# Altium project VCO.PrjPCB
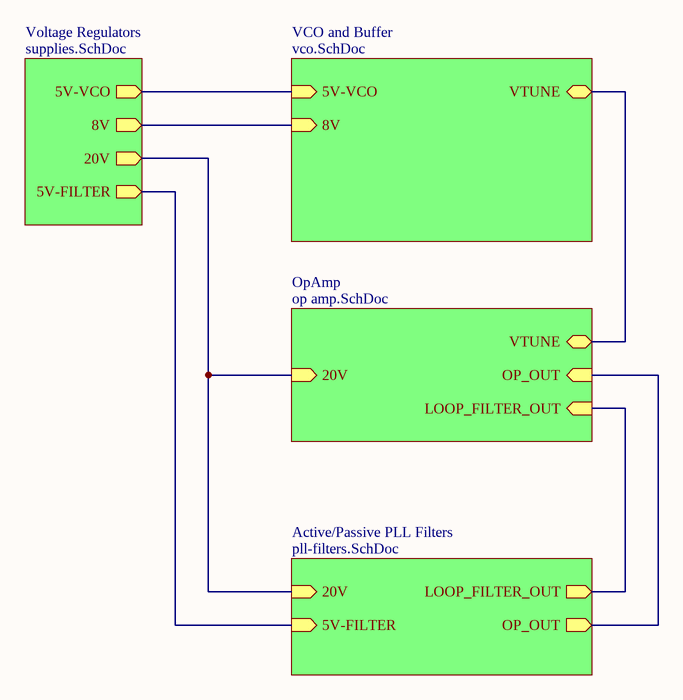
[diagram p0: vco-brd.SchDoc]
5 sheets, 241 parts. Net scope: hierarchical (ports join the sheet entries above them; power ports are global).
Board file: VCO.PcbDoc
Sheets:
  vco-brd.SchDoc
    Voltage Regulators = supplies.SchDoc
    VCO and Buffer = vco.SchDoc
    OpAmp = op amp.SchDoc
    Active/Passive PLL Filters = pll-filters.SchDoc

## Sheet vco-brd.SchDoc
size A

### Sub-sheets
Active/Passive PLL Filters = pll-filters.SchDoc: 5V-FILTER (in), 20V (in), LOOP_FILTER_OUT (out), OP_OUT (out)
OpAmp = op amp.SchDoc: 20V (in), VTUNE (bidir), LOOP_FILTER_OUT (in), OP_OUT (in)
VCO and Buffer = vco.SchDoc: 5V-VCO (in), 8V (in), VTUNE (bidir)
Voltage Regulators = supplies.SchDoc: 5V-VCO (out), 8V (out), 20V (out), 5V-FILTER (out)

### Nets
5V-FILTER: sheet Voltage Regulators/5V-FILTER, sheet Active/Passive PLL Filters/5V-FILTER
5V-VCO: sheet Voltage Regulators/5V-VCO, sheet VCO and Buffer/5V-VCO
8V: sheet Voltage Regulators/8V, sheet VCO and Buffer/8V
20V: sheet Voltage Regulators/20V, sheet OpAmp/20V, sheet Active/Passive PLL Filters/20V
LOOP_FILTER_OUT: sheet OpAmp/LOOP_FILTER_OUT, sheet Active/Passive PLL Filters/LOOP_FILTER_OUT
OP_OUT: sheet OpAmp/OP_OUT, sheet Active/Passive PLL Filters/OP_OUT
VTUNE: sheet VCO and Buffer/VTUNE, sheet OpAmp/VTUNE

## Sheet supplies.SchDoc
size A
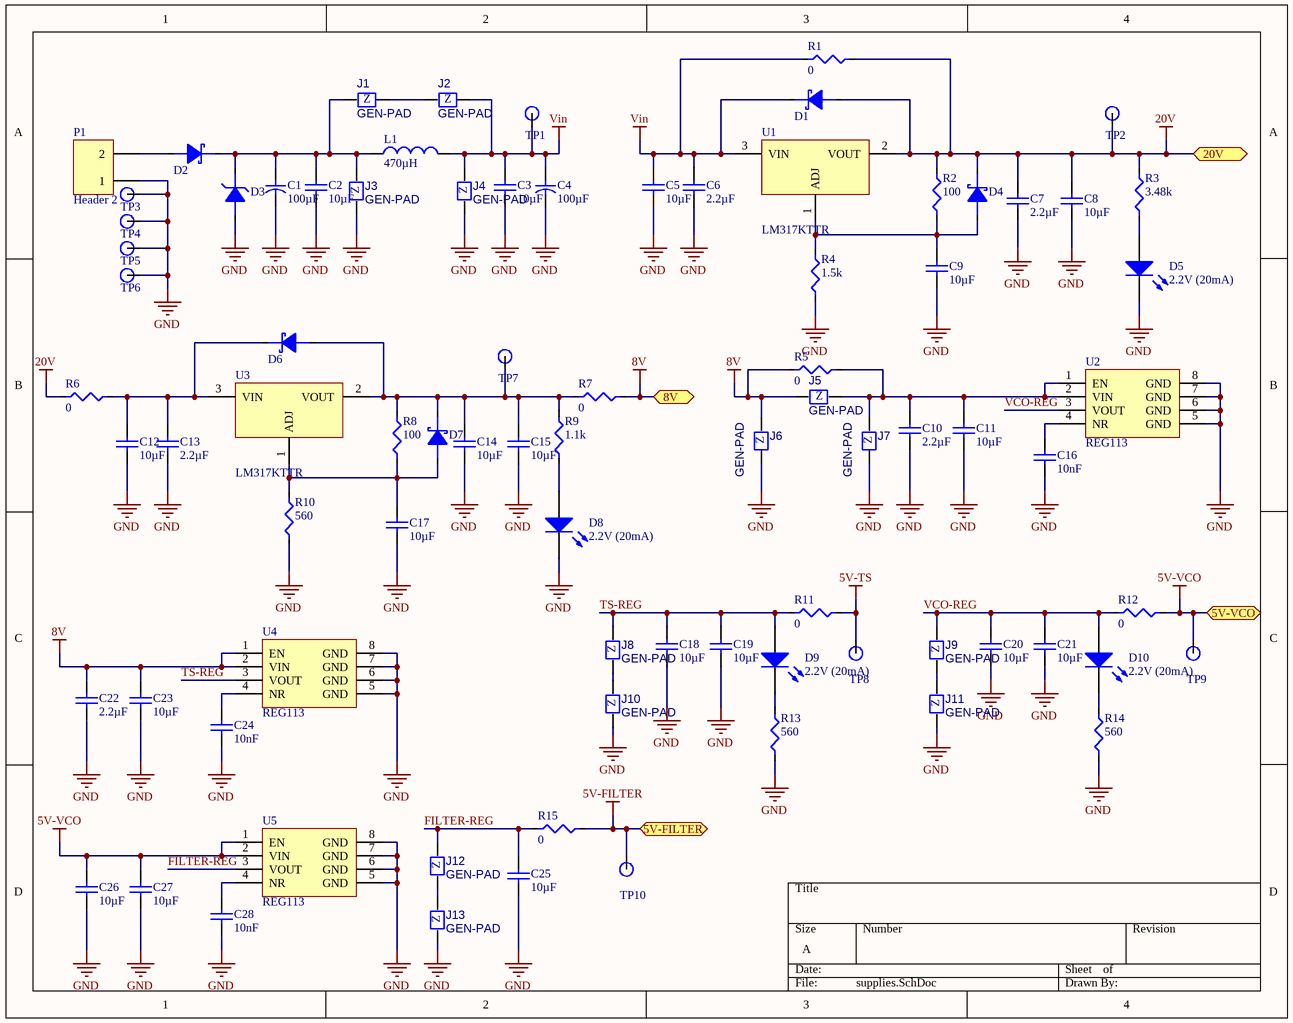
[diagram p1: supplies.SchDoc]

### Parts
C1  100µF  [Radial-SMD-8x10mm]
C2  10µF  [C0805-1.25MM]
C3  10µF  [C0805-1.25MM]
C4  100µF  [Radial-SMD-8x10mm]
C5  10µF  [C0805-1.25MM]
C6  2.2µF  [0402-0.55mm]
C7  2.2µF  [0402-0.55mm]
C8  10µF  [C0805-1.25MM]
C9  10µF  [C0805-1.25MM]
C10  2.2µF  [0402-0.55mm]
C11  10µF  [C0805-1.25MM]
C12  10µF  [C0805-1.25MM]
C13  2.2µF  [0402-0.55mm]
C14  10µF  [0402-0.55mm]
C15  10µF  [0402-0.55mm]
C16  10nF  [C0805-1.25MM]
C17  10µF  [C0805-1.25MM]
C18  10µF  [0402-0.55mm]
C19  10µF  [0402-0.55mm]
C20  10µF  [0402-0.55mm]
C21  10µF  [0402-0.55mm]
C22  2.2µF  [0402-0.55mm]
C23  10µF  [C0805-1.25MM]
C24  10nF  [C0805-1.25MM]
C25  10µF  [0402-0.55mm]
C26  10µF  [0402-0.55mm]
C27  10µF  [0402-0.55mm]
C28  10nF  [C0805-1.25MM]
D1  SCHOTTKY  [SOD-123f]  (value not drawn)
D2  SCHOTTKY  [SOD-123f]  (value not drawn)
D3  ZENER  [DO-214AA]  (value not drawn)
D4  SCHOTTKY  [SOD-123f]  (value not drawn)
D5  2.2V (20mA)  [0805-LED]
D6  SCHOTTKY  [SOD-123f]  (value not drawn)
D7  SCHOTTKY  [SOD-123f]  (value not drawn)
D8  2.2V (20mA)  [0805-LED]
D9  2.2V (20mA)  [0805-LED]
D10  2.2V (20mA)  [0805-LED]
J1  GEN-PAD  [0805-DNP]
J2  GEN-PAD  [0805-DNP]
J3  GEN-PAD  [0805-DNP]
J4  GEN-PAD  [0805-DNP]
J5  GEN-PAD  [0805-DNP]
J6  GEN-PAD  [0805-DNP]
J7  GEN-PAD  [0805-DNP]
J8  GEN-PAD  [0805-DNP]
J9  GEN-PAD  [0805-DNP]
J10  GEN-PAD  [0805-DNP]
J11  GEN-PAD  [0805-DNP]
J12  GEN-PAD  [0805-DNP]
J13  GEN-PAD  [0805-DNP]
L1  value 470µH  [7447709471]  (hidden comment: L)
P1  Header 2  [HDR1X2]
R1  0  [0805-0.45MM]
R2  100  [0805-0.45MM]
R3  3.48k  [0805-0.45MM]
R4  1.5k  [0805-0.45MM]
R5  0  [0805-0.45MM]
R6  0  [0805-0.45MM]
R7  0  [0805-0.45MM]
R8  100  [0805-0.45MM]
R9  1.1k  [0805-0.45MM]
R10  560  [0805-0.45MM]
R11  0  [0805-0.45MM]
R12  0  [0805-0.45MM]
R13  560  [0805-0.45MM]
R14  560  [0805-0.45MM]
R15  0  [0805-0.45MM]
TP1  TP-LOOP  [TP-LOOP]  (value not drawn)
TP2  TP-LOOP  [TP-LOOP]  (value not drawn)
TP3  TP-LOOP  [TP-LOOP]  (value not drawn)
TP4  TP-LOOP  [TP-LOOP]  (value not drawn)
TP5  TP-LOOP  [TP-LOOP]  (value not drawn)
TP6  TP-LOOP  [TP-LOOP]  (value not drawn)
TP7  TP-LOOP  [TP-LOOP]  (value not drawn)
TP8  TP-LOOP  [TP-LOOP]  (value not drawn)
TP9  TP-LOOP  [TP-LOOP]  (value not drawn)
TP10  TP-LOOP  [TP-LOOP]  (value not drawn)
U1  LM317KTTR  [TO-263-4]
U2  REG113  [MSOP8]
U3  LM317KTTR  [TO-263-4]
U4  REG113  [MSOP8]
U5  REG113  [MSOP8]

### Ports
5V-FILTER, 5V-VCO, 8V, 20V

### Nets
5V-FILTER: R15.2 TP10.0 ; port 5V-FILTER
5V-TS: R11.2 TP8.0
5V-VCO: C26.1 C27.1 R12.1 TP9.0 U5.1(EN) U5.2(VIN) ; port 5V-VCO
8V: C22.2 C23.2 J5.2 J6.1 R5.1 R7.2 U4.1(EN) U4.2(VIN) ; port 8V
20V: C7.2 C8.2 D1.A D4.C R1.2 R2.2 R3.2 R6.1 TP2.0 U1.2(VOUT) ; port 20V
GND: C1.1 C2.1 C3.1 C4.1 C5.1 C6.1 C7.1 C8.1 C9.1 C10.1 C11.1 C12.1 C13.1 C14.1 C15.1 C16.1 C17.1 C18.1 C19.1 C20.1 C21.1 C22.1 C23.1 C24.1 C25.2 C26.2 C27.2 C28.1 D3.1(A) D5.C D8.C J3.2 J4.2 J6.2 J7.2 J10.2 J11.2 J13.2 P1.1 R4.1 R10.1 R13.1 R14.1 TP3.0 TP4.0 TP5.0 TP6.0 U2.5(GND) U2.6(GND) U2.7(GND) U2.8(GND) U4.5(GND) U4.6(GND) U4.7(GND) U4.8(GND) U5.5(GND) U5.6(GND) U5.7(GND) U5.8(GND)
Vin: C3.2 C4.2 C5.2 C6.2 D1.C J2.1 J4.1 L1.2 R1.1 TP1.0 U1.3(VIN)
FILTER-REG: C25.1 J12.1 R15.1 U5.3(VOUT)
TS-REG: C18.2 C19.2 D9.A J8.1 R11.1 U4.3(VOUT)
VCO-REG: C20.2 C21.2 D10.A J9.1 R12.2 U2.3(VOUT)
NetC1_2: C1.2 C2.2 D2.C D3.2(C) J1.2 J3.1 L1.1
NetC9_2: C9.2 D4.A R2.1 R4.2 U1.1(ADJ)
NetC10_2: C10.2 C11.2 J5.1 J7.1 R5.2 U2.1(EN) U2.2(VIN)
NetC12_2: C12.2 C13.2 D6.C R6.2 U3.3(VIN)
NetC14_2: C14.2 C15.2 D6.A D7.C R7.1 R8.2 R9.2 TP7.0 U3.2(VOUT)
NetC16_2: C16.2 U2.4(NR)
NetC17_2: C17.2 D7.A R8.1 R10.2 U3.1(ADJ)
NetC24_2: C24.2 U4.4(NR)
NetC28_2: C28.2 U5.4(NR)
NetD2_A: D2.A P1.2
NetD5_A: D5.A R3.1
NetD8_A: D8.A R9.1
NetD9_C: D9.C R13.2
NetD10_C: D10.C R14.2
NetJ1_1: J1.1 J2.2
NetJ8_2: J8.2 J10.1
NetJ9_2: J9.2 J11.1
NetJ12_2: J12.2 J13.1

### Notes on the sheet
- (in symbol EE-GEN-00001) Z

### Library data of the parts
C1 C4 = Radial-SMD-8x10mm: CAP-POL; EE Part Number: EE-CAP-00001; Part Description: CAP ALUM 100UF 50V 20% SMD; Manufacturer: Nichicon; Manufacturer Part Number: UWT1H101MNL1GS; Record Number: 1; Voltage: 50V; Value: 100µF; Datasheet Link: UWT1H101MNL1GS; Supplier 1: DigiKey; Supplier Part Number 1: 493-2226-1-ND; Supplier Link 1: DigiKey; Supplier 2: Mouser; Supplier Part Number 2: 647-UWT1H101MNL1S; Supplier Link 2: Mouser
C2 C3 C5 C8 C9 C12 C17 = C0805-1.25MM: Capacitor; EE Part Number: EE-CAP-00002; Part Description: CAP CER 10UF 35V 10% JB 0805; Manufacturer: TDK; Manufacturer Part Number: C2012JB1V106K085AC; Record Number: 2; Voltage: 35V; PackageDescription: Chip Capacitor; Value: 10µF; Datasheet Link: C2012JB1V106K085AC; Supplier 1: DigiKey; Supplier Part Number 1: 445-11516-1-ND; Supplier Link 1: DigiKey
C6 C7 C13 = 0402-0.55mm: Capacitor; EE Part Number: EE-CAP-00003; Part Description: CAP CER 2.2UF 35V 10% X5R 0402; Manufacturer: TDK; Manufacturer Part Number: C1005X5R1V225K050BC; Record Number: 3; Voltage: 35V; PackageDescription: Chip Capacitor; Value: 2.2µF; Datasheet Link: C1005X5R1V225K050BC; Supplier 1: DigiKey; Supplier Part Number 1: 445-9028-1-ND; Supplier Link 1: DigiKey; Supplier 2: Mouser; Supplier Part Number 2: 810-C1005X5R1V225K; Supplier Link 2: Mouser
C10 C22 = EE-CAP-00003: Capacitor; Part Description: CAP CER 2.2UF 35V 10% X5R 0402; Manufacturer: TDK; Manufacturer Part Number: C1005X5R1V225K050BC; Record Number: 3; Voltage: 35V; PackageDescription: Chip Capacitor; EE Part Number: EE-CAP-00003; Value: 2.2µF; Datasheet Link: C1005X5R1V225K050BC; Supplier 1: DigiKey; Supplier Part Number 1: 445-9028-1-ND; Supplier Link 1: DigiKey; Supplier 2: Mouser; Supplier Part Number 2: 810-C1005X5R1V225K; Supplier Link 2: Mouser
C11 C23 = EE-CAP-00002: Capacitor; Part Description: CAP CER 10UF 35V 10% JB 0805; Manufacturer: TDK; Manufacturer Part Number: C2012JB1V106K085AC; Record Number: 2; Voltage: 35V; PackageDescription: Chip Capacitor; EE Part Number: EE-CAP-00002; Value: 10µF; Datasheet Link: C2012JB1V106K085AC; Supplier 1: DigiKey; Supplier Part Number 1: 445-11516-1-ND; Supplier Link 1: DigiKey
C14 C15 = EE-CAP-00009: Capacitor; Part Description: CAP CER 10UF 10V 20% X5R 0402; Manufacturer: Samsung; Manufacturer Part Number: CL05A106MP5NUNC; Record Number: 9; Voltage: 10V; PackageDescription: Chip Capacitor; EE Part Number: EE-CAP-00009; Value: 10µF; Datasheet Link: CL05A106MP5NUNC; Supplier 1: DigiKey; Supplier Part Number 1: 1276-1450-1-ND; Supplier Link 1: DigiKey
C16 C24 C28 = EE-CAP-00010: Capacitor; Part Description: CAP CER 10000PF 50V 10% X7R 0805; Manufacturer: Murata; Manufacturer Part Number: GRM216R71H103KA01D; Record Number: 10; Voltage: 50V; PackageDescription: Chip Capacitor; EE Part Number: EE-CAP-00010; Value: 10nF; Datasheet Link: GRM216R71H103KA01D; Supplier 1: DigiKey; Supplier Part Number 1: 490-1664-1-ND; Supplier Link 1: DigiKey; Supplier 2: Mouser; Supplier Part Number 2: 81-GRM40X103K50D; Supplier Link 2: Mouser
C18-C21 C25-C27 = EE-CAP-00004: Capacitor; Part Description: CAP CER 10UF 10V 20% X5R 0402; Manufacturer: Samsung; Manufacturer Part Number: CL05A106MP5NUNC; Record Number: 4; Voltage: 10V; PackageDescription: Chip Capacitor; EE Part Number: EE-CAP-00004; Value: 10µF; Datasheet Link: CL05A106MP5NUNC; Supplier 1: DigiKey; Supplier Part Number 1: 1276-1450-1-ND; Supplier Link 1: DigiKey
D1 D2 D4 D6 D7 = 1A: Schottky Diode; EE Part Number: EE-DIODE-00002; Part Description: DIODE SCHOTTKY 30V 1A SFLAT; Manufacturer: Toshiba; Manufacturer Part Number: CRS01(TE85L,Q,M); Record Number: 2; Value: 30V (1A); Voltage: 30V; Current: 1A; Datasheet Link: CRS01(TE85L,Q,M); Supplier 1: DigiKey; Supplier Part Number 1: CRS01QCT-ND; Supplier Link 1: DigiKey; Supplier 2: Mouser; Supplier Part Number 2: 757-CRS01(TE85L,Q,M); Supplier Link 2: Mouser
D3 = EE-DIODE-00004: Part Description: DIODE ZENER 25V 5W DO214AA; Manufacturer: Micro; Manufacturer Part Number: SMBJ5360B-TP; Record Number: 4; Value: 25V (190mA); Voltage: 25V; Current: 190mA; EE Part Number: EE-DIODE-00004; Datasheet Link: SMBJ5360B-TP; Supplier 1: DigiKey; Supplier Part Number 1: SMBJ5360B-TPMSCT-ND; Supplier Link 1: DigiKey
D5 D8-D10 = EE-DIODE-00003: LED; Part Description: LED CHIPLED 570NM GREEN 0805 SMD; Manufacturer: OSRAM; Manufacturer Part Number: LG R971-KN-1; Record Number: 3; Revision: July-2002: Re-released for DXP Platform.; EE Part Number: EE-DIODE-00003; Value: 2.2V (20mA); Voltage: 2.2V; Current: 20mA; Datasheet Link: LG R971-KN-1; Supplier 1: DigiKey; Supplier Part Number 1: 475-1410-1-ND; Supplier Link 1: DigiKey; Supplier 2: Mouser; Supplier Part Number 2: 720-LGR971-KN-1; Supplier Link 2: Mouser
J1-J13 = EE-GEN-00001: Generic Component; Part Description: 0805 Generic Comp; Record Number: 1; EE Part Number: EE-GEN-00001; Value: GEN-0805; Pins: 2; Manufacturer: N/A; Manufacturer Part Number: N/A; Supplier 1: N/A; Supplier Part Number 1: N/A
L1 = 1.4A: Inductor; EE Part Number: EE-L-00002; Part Description: INDUCTOR POWER 470UH 1.4A SMD; Manufacturer: Wurth; Record Number: 2; Current: 1.4A; Tolerance: ±20%; Resistance: 560 mOhm Max; Manufacturer Part Number: 7447709471; Datasheet Link: 7447709471; Supplier 1: DigiKey; Supplier Part Number 1: 732-1699-1-ND; Supplier Link 1: DigiKey; Supplier 2: Mouser; Supplier Part Number 2: 710-7447709471; Supplier Link 2: Mouser
P1 = EM-CON-00012: Part Description: 2-Pin 0.1" Vertical Header; Manufacturer: 3M; Record Number: 12; Value: 961102-6404-AR; EM Part Number: EM-CON-00012; Pins: 2; Manufacturer Part Number: 961102-6404-AR; Supplier 1: Digi-Key; Supplier Part Number 1: 3M9447-ND
R1 R5-R7 R11 R12 R15 = EM-RES-01617: Part Description: RES 0.0 OHM .33W 0805 SMD; Manufacturer: Vishay; Manufacturer Part Number: CRCW08050000Z0EAHP; Record Number: 1617; Power: 0.33W; EM Part Number: EM-RES-01617; Value: 0; Tolerance: N/A; Datasheet Link: http://www.vishay.com/docs/20043/crcwhpe3.pdf; Supplier 1: Digi-Key; Supplier Part Number 1: 541-0.0TBCT-ND; Supplier Link 1: http://www.Digi-Key.com/product-detail/en/CRCW08050000Z0EAHP/541-0.0TBCT-ND/2222831
R2 R8 = EM-RES-01370: Part Description: RES 100 OHM 1/8W 1% 0805 SMD; Manufacturer: Vishay; Manufacturer Part Number: CRCW0805100RFKEA; Record Number: 1370; Tolerance: 1%; Power: 0.125W; EM Part Number: EM-RES-01370; Value: 100; Supplier 1: Digi-Key; Supplier Part Number 1: 541-100CCT-ND
R3 = EM-RES-01196: Part Description: RES 3.48K OHM 1/8W 1% 0805 SMD; Manufacturer: Vishay; Manufacturer Part Number: CRCW08053K48FKEA; Record Number: 1196; Tolerance: 1%; Power: 0.125W; EM Part Number: EM-RES-01196; Value: 3.48k; Supplier 1: Digi-Key; Supplier Part Number 1: 541-3.48KCCT-ND
R4 = EM-RES-01238: Part Description: RES 1.50K OHM 1/8W 1% 0805 SMD; Manufacturer: Vishay; Manufacturer Part Number: CRCW08051K50FKEA; Record Number: 1238; Tolerance: 1%; Power: 0.125W; EM Part Number: EM-RES-01238; Value: 1.5k; Supplier 1: Digi-Key; Supplier Part Number 1: 541-1.50KCCT-ND
R9 = EM-RES-01252: Part Description: RES 1.10K OHM 1/8W 1% 0805 SMD; Manufacturer: Vishay; Manufacturer Part Number: CRCW08051K10FKEA; Record Number: 1252; Tolerance: 1%; Power: 0.125W; EM Part Number: EM-RES-01252; Value: 1.1k; Supplier 1: Digi-Key; Supplier Part Number 1: 541-1.10KCCT-ND
R10 R13 R14 = EM-RES-01285: Part Description: RES 560 OHM 1/8W 1% 0805 SMD; Manufacturer: Vishay; Manufacturer Part Number: CRCW0805560RFKEA; Record Number: 1285; Tolerance: 1%; Power: 0.125W; EM Part Number: EM-RES-01285; Value: 560; Supplier 1: Digi-Key; Supplier Part Number 1: 541-560CCT-ND
TP1-TP10 = EM-TP-00006: Part Description: 0.040" Test Point; Record Number: 6; EM Part Number: EM-TP-00006; Value: TP-LOOP; Pins: 1; Manufacturer: N/A; Manufacturer Part Number: N/A; Supplier 1: N/A; Supplier Part Number 1: N/A
U1 U3 = EE-VREG-00004: Part Description: IC REG LDO ADJ 1.5A DDPAK; Manufacturer: TI; Record Number: 4; Input Voltage: 4.2 V ~ 40 V; Fixed/Adjustable: Positive Adjustable; Output Voltage: 1.25 V ~ 37 V; EE Part Number: EE-VREG-00004; Value: LM317KTTR; Type: Buck; Manufacturer Part Number: LM317KTTR; Datasheet Link: LM317KTTR; Supplier 1: DigiKey; Supplier Part Number 1: 296-21390-1-ND; Supplier Link 1: DigiKey; Supplier 2: Mouser; Supplier Part Number 2: 595-LM317KTTR; Supplier Link 2: Mouser
U2 U4 = EE-VREG-00002: Part Description: IC REG LDO 5V 0.4A 8VSSOP; Manufacturer: TI; Record Number: 2; Value: REG113EA-5/250; Input Voltage: Up to 10V; Fixed/Adjustable: Positive Fixed; Output Voltage: 5V; EE Part Number: EE-VREG-00002; Type: Buck; Manufacturer Part Number: REG113EA-5/250; Datasheet Link: REG113EA-5/250; Supplier 1: DigiKey; Supplier Part Number 1: 296-29170-1-ND; Supplier Link 1: DigiKey; Supplier 2: Mouser; Supplier Part Number 2: 595-REG113EA-5/250; Supplier Link 2: Mouser
U5 = EE-VREG-00003: Part Description: IC REG LDO 2.5V 0.4A 8VSSOP; Manufacturer: TI; Record Number: 3; Value: REG113EA-2.5/2K5; Input Voltage: Up to 10V; Fixed/Adjustable: Positive Fixed; Output Voltage: 2.5V; EE Part Number: EE-VREG-00003; Type: Buck; Manufacturer Part Number: REG113EA-2.5/2K5; Datasheet Link: REG113EA-2.5/2K5; Supplier 1: DigiKey; Supplier Part Number 1: REG113EA2.52K5CT-ND; Supplier Link 1: DigiKey

## Sheet vco.SchDoc
size A
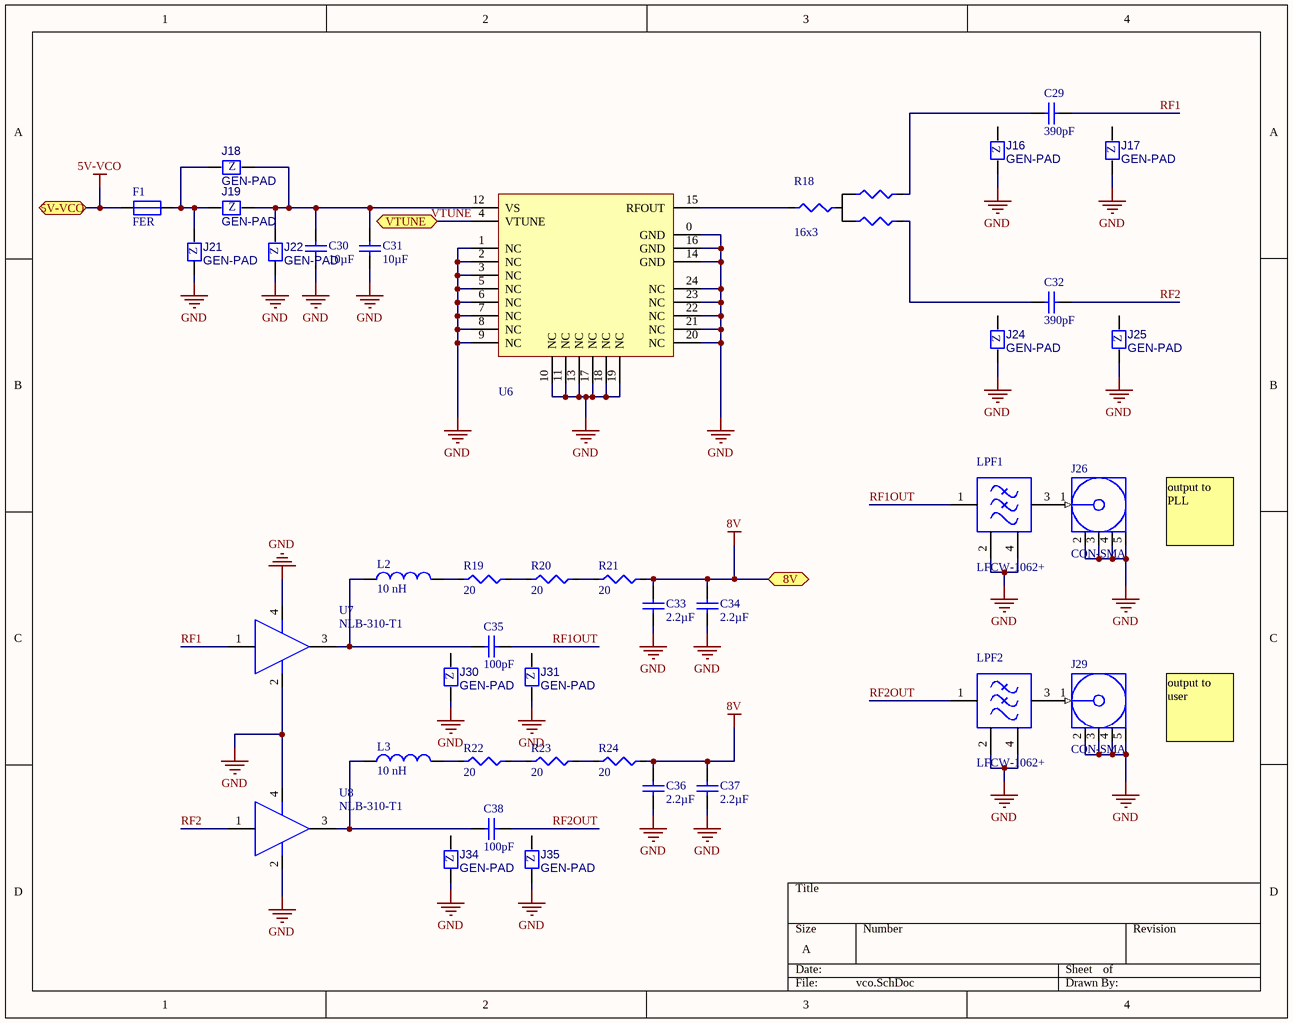
[diagram p2: vco.SchDoc]

### Parts
C29  390pF  [0402-RF-0.55mm]
C30  10µF  [0402-0.55mm]
C31  10µF  [0402-0.55mm]
C32  390pF  [0402-RF-0.55mm]
C33  2.2µF  [0402-0.55mm]
C34  2.2µF  [0402-0.55mm]
C35  100pF  [0402-RF-0.55mm]
C36  2.2µF  [0402-0.55mm]
C37  2.2µF  [0402-0.55mm]
C38  100pF  [0402-RF-0.55mm]
F1  FER  [0603-0.8mm]
J16  GEN-PAD  [0402-DNP]
J17  GEN-PAD  [0402-DNP]
J18  GEN-PAD  [0805-DNP]
J19  GEN-PAD  [0805-DNP]
J21  GEN-PAD  [0805-DNP]
J22  GEN-PAD  [0805-DNP]
J24  GEN-PAD  [0402-DNP]
J25  GEN-PAD  [0402-DNP]
J26  CON-SMA  [CON-COAX]
J29  CON-SMA  [CON-COAX]
J30  GEN-PAD  [0402-DNP]
J31  GEN-PAD  [0402-DNP]
J34  GEN-PAD  [0402-DNP]
J35  GEN-PAD  [0402-DNP]
L2  value 10 nH  [L0603-0.8mm]  (hidden comment: L)
L3  value 10 nH  [L0603-0.8mm]  (hidden comment: L)
LPF1  LFCW-1062+  [LPF-0603-0.8mm]
LPF2  LFCW-1062+  [LPF-0603-0.8mm]
R18  16x3  [0402-SPLIT-3-0.55mm]
R19  20  [0805-0.45MM]
R20  20  [0805-0.45MM]
R21  20  [0805-0.45MM]
R22  20  [0805-0.45MM]
R23  20  [0805-0.45MM]
R24  20  [0805-0.45MM]
U6  RFVC1801  [QFN-24-(4x4)]  (value not drawn)
U7  NLB-310-T1  [SOT-86]
U8  NLB-310-T1  [SOT-86]

### Ports
5V-VCO, 8V, VTUNE

### Nets
5V-VCO: F1.2 ; port 5V-VCO
8V: C33.2 C34.2 C36.2 C37.2 R21.2 R24.2 ; port 8V
GND: C30.1 C31.1 C33.1 C34.1 C36.1 C37.1 J16.2 J17.2 J21.2 J22.2 J24.2 J25.2 J26.2(GND) J26.3(GND) J26.4(GND) J26.5(GND) J29.2(GND) J29.3(GND) J29.4(GND) J29.5(GND) J30.2 J31.2 J34.2 J35.2 LPF1.2(GND) LPF1.4(GND) LPF2.2(GND) LPF2.4(GND) U6.0(GND) U6.1(NC) U6.2(NC) U6.3(NC) U6.5(NC) U6.6(NC) U6.7(NC) U6.8(NC) U6.9(NC) U6.10(NC) U6.11(NC) U6.13(NC) U6.14(GND) U6.16(GND) U6.17(NC) U6.18(NC) U6.19(NC) U6.20(NC) U6.21(NC) U6.22(NC) U6.23(NC) U6.24(NC) U7.2(GND) U7.4(GND) U8.2(GND) U8.4(GND)
RF1: C29.2 U7.1(RFIN)
RF1OUT: C35.2 LPF1.1(RF-IN)
RF2: C32.2 U8.1(RFIN)
RF2OUT: C38.2 LPF2.1(RF-IN)
VTUNE: U6.4(VTUNE) ; port VTUNE
NetC29_1: C29.1 R18.2
NetC30_2: C30.2 C31.2 J18.1 J19.1 J22.1 U6.12(VS)
NetC32_1: C32.1 R18.3
NetC35_1: C35.1 L2.1 U7.3(RFOUT)
NetC38_1: C38.1 L3.1 U8.3(RFOUT)
NetF1_1: F1.1 J18.2 J19.2 J21.1
NetJ26_1: J26.1(Signal) LPF1.3(RF-OUT)
NetJ29_1: J29.1(Signal) LPF2.3(RF-OUT)
NetL2_2: L2.2 R19.1
NetL3_2: L3.2 R22.1
NetR18_1: R18.1 U6.15(RFOUT)
NetR19_2: R19.2 R20.1
NetR20_2: R20.2 R21.1
NetR22_2: R22.2 R23.1
NetR23_2: R23.2 R24.1

Not connected (* = marked no-connect by the designer): J16 1; J17 1; J24 1; J25 1; J30 1; J31 1; J34 1; J35 1

### Notes on the sheet
- (near J26) output to PLL
- (near J29) output to user
- Labels drawn without touching a wire or pin: VTUNE
- (in symbol EE-GEN-00001) Z
- (in symbol EE-GEN-00002) Z

### Library data of the parts
C29 C32 = EE-CAP-00016: Capacitor; Part Description: CAP CER 390PF 50V 10% X7R 0402; Manufacturer: Murata; Manufacturer Part Number: GRM155R71H391KA01D; Record Number: 16; Voltage: 50V; PackageDescription: Chip Capacitor; EE Part Number: EE-CAP-00016; Value: 390pF; Datasheet Link: GRM155R71H391KA01D; Supplier 1: DigiKey; Supplier Part Number 1: 490-3249-1-ND; Supplier Link 1: DigiKey; Supplier 2: Mouser; Supplier Part Number 2: 81-GRM155R71H391KA1D; Supplier Link 2: Mouser
C30 C31 = EE-CAP-00009: as C14 on sheet supplies; PackageDescription: Chip Capacitor; EE Part Number: EE-CAP-00009; Value: 10µF; Datasheet Link: CL05A106MP5NUNC; Supplier 1: DigiKey; Supplier Part Number 1: 1276-1450-1-ND; Supplier Link 1: DigiKey
C33 C34 C36 C37 = EE-CAP-00003: as C10 on sheet supplies; PackageDescription: Chip Capacitor; EE Part Number: EE-CAP-00003; Value: 2.2µF; Datasheet Link: C1005X5R1V225K050BC; Supplier 1: DigiKey; Supplier Part Number 1: 445-9028-1-ND; Supplier Link 1: DigiKey; Supplier 2: Mouser; Supplier Part Number 2: 810-C1005X5R1V225K; Supplier Link 2: Mouser
C35 C38 = EE-CAP-00017: Capacitor; Part Description: CAP CER 100PF 25V 1% NP0 0402; Manufacturer: Kemet; Manufacturer Part Number: CBR04C101F3GAC; Record Number: 17; Voltage: 25V; PackageDescription: Chip Capacitor; EE Part Number: EE-CAP-00017; Value: 100pF; Datasheet Link: CBR04C101F3GAC; Supplier 1: DigiKey; Supplier Part Number 1: 399-11246-1-ND; Supplier Link 1: DigiKey; Supplier 2: Mouser; Supplier Part Number 2: 80-CBR04C101F3GAC; Supplier Link 2: Mouser
F1 = EE-FER-00001: Part Description: FERRITE CHIP SIGNAL 2200 OHM SMD; Manufacturer: Laird-Signal; Manufacturer Part Number: HZ0603A222R-10; Record Number: 1; Value: 2.2k Ohms; Resistance (mOhms): 1500; Current (A): 100mA; Impedance @ 100MHz: 2200; EE Part Number: EE-FER-00001; Datasheet Link: HZ0603A222R-10; Supplier 1: DigiKey; Supplier Part Number 1: 240-2377-1-ND; Supplier Link 1: DigiKey; Supplier 2: Mouser; Supplier Part Number 2: 875-HZ0603A222R-10; Supplier Link 2: Mouser
J16 J17 J24 J25 J30 J31 J34 J35 = EE-GEN-00002: Generic Component; Part Description: 0402 Generic Comp; Record Number: 2; EE Part Number: EE-GEN-00002; Value: GEN-0402; Pins: 2; Manufacturer: N/A; Manufacturer Part Number: N/A; Supplier 1: N/A; Supplier Part Number 1: N/A
J18 J19 J21 J22 = EE-GEN-00001: as J1 on sheet supplies; EE Part Number: EE-GEN-00001; Value: GEN-0805; Pins: 2; Manufacturer: N/A; Manufacturer Part Number: N/A; Supplier 1: N/A; Supplier Part Number 1: N/A
J26 J29 = EE-CON-00001: Part Description: SMA Jack, 1.73mm (.068) Board Clearance, End Launched, DC-26.5 GHz, Gold plated.; Manufacturer: East Coast Microwave; Manufacturer Part Number: PSF-S01-008; Record Number: 1; Value: SMA-1.73mm; EE Part Number: EE-CON-00001; Pins: 5; Datasheet Link: PSF-S01-008; Supplier 1: ECM; Supplier Part Number 1: PSF-S01-008; Supplier Link 1: ECM
L2 L3 = 800mA: Inductor; EE Part Number: EE-L-00001; Part Description: INDUCTOR 10NH 800MA; Manufacturer: Murata; Manufacturer Part Number: LQW18AN10NG10D; Record Number: 1; Current: 800mA; Tolerance: ±2%; Resistance: 58 mOhm Max; Datasheet Link: LQW18AN10NG10D; Supplier 1: DigiKey; Supplier Part Number 1: 490-6857-1-ND; Supplier Link 1: DigiKey; Supplier 2: Mouser; Supplier Part Number 2: 81-LQW18AN10NG10D; Supplier Link 2: Mouser
LPF1 LPF2 = EE-FILTER-00001: Part Description: LTCC Low Pass Filter; Manufacturer: Mini-Circuits; Record Number: 1; Frequency Range: DC to 10.6 GHz; Impedance: 50 Ω; Power: 4W; EE Part Number: EE-FILTER-00001; Value: LFCW-1062+; Package: LPF-0603-0.8mm; Manufacturer Part Number: LFCW-1062+; Datasheet Link: LFCW-1062+; Supplier 1: Mini-Circuits; Supplier Part Number 1: LFCW-1062+; Supplier Link 1: Mini-Circuits
R18 = EE-RES-00003: Part Description: Resistor Splitter; Record Number: 3; Tolerance: ±1%; Power: 0.1W, 1/10W; EE Part Number: EE-RES-00003; Value: 16x3; Manufacturer: N/A; Manufacturer Part Number: N/A; Datasheet Link: N/A; Supplier 1: N/A; Supplier Part Number 1: N/A; Supplier Link 1: N/A
R19-R24 = EM-RES-01452: Part Description: RES 20.0 OHM 1/8W 1% 0805 SMD; Manufacturer: Vishay; Manufacturer Part Number: CRCW080520R0FKEA; Record Number: 1452; Tolerance: 1%; Power: 0.125W; EM Part Number: EM-RES-01452; Value: 20; Supplier 1: Digi-Key; Supplier Part Number 1: 541-20.0CCT-ND
U6 = QFN-24-(4x4): EE Part Number: EE-MISC-00001; Part Description: IC MMIC VCO BUF AMP 24-QFN; Manufacturer: RFMD; Record Number: 1; Value: RFVC1801SQ; Voltage: 5.5V; Package: 24-QFN-EP (4x4); Manufacturer Part Number: RFVC1801SQ; Datasheet: RFVC1801SQ; Supplier 1: RFMD; Supplier Part Number 1: RFVC1801SQ; Supplier Link 1: RFMD
U7 U8 = SOT-86: EE Part Number: EE-OPAMP-00001; Part Description: IC AMP MMIC GAAS 10GHZ 4-MICROX; Manufacturer: RFMD; Record Number: 1; Frequency Range: 0Hz ~ 10GHz; Voltage: 4.4 V ~ 4.8 V; Drive Current: 50mA; Value: NLB-310-T1; Channels: 1; Package: SOT-86; Manufacturer Part Number: NLB-310-T1; Datasheet Link: NLB-310-T1; Supplier 1: DigiKey; Supplier Part Number 1: NLB-310-T1; Supplier Link 1: DigiKey

## Sheet op amp.SchDoc
size A
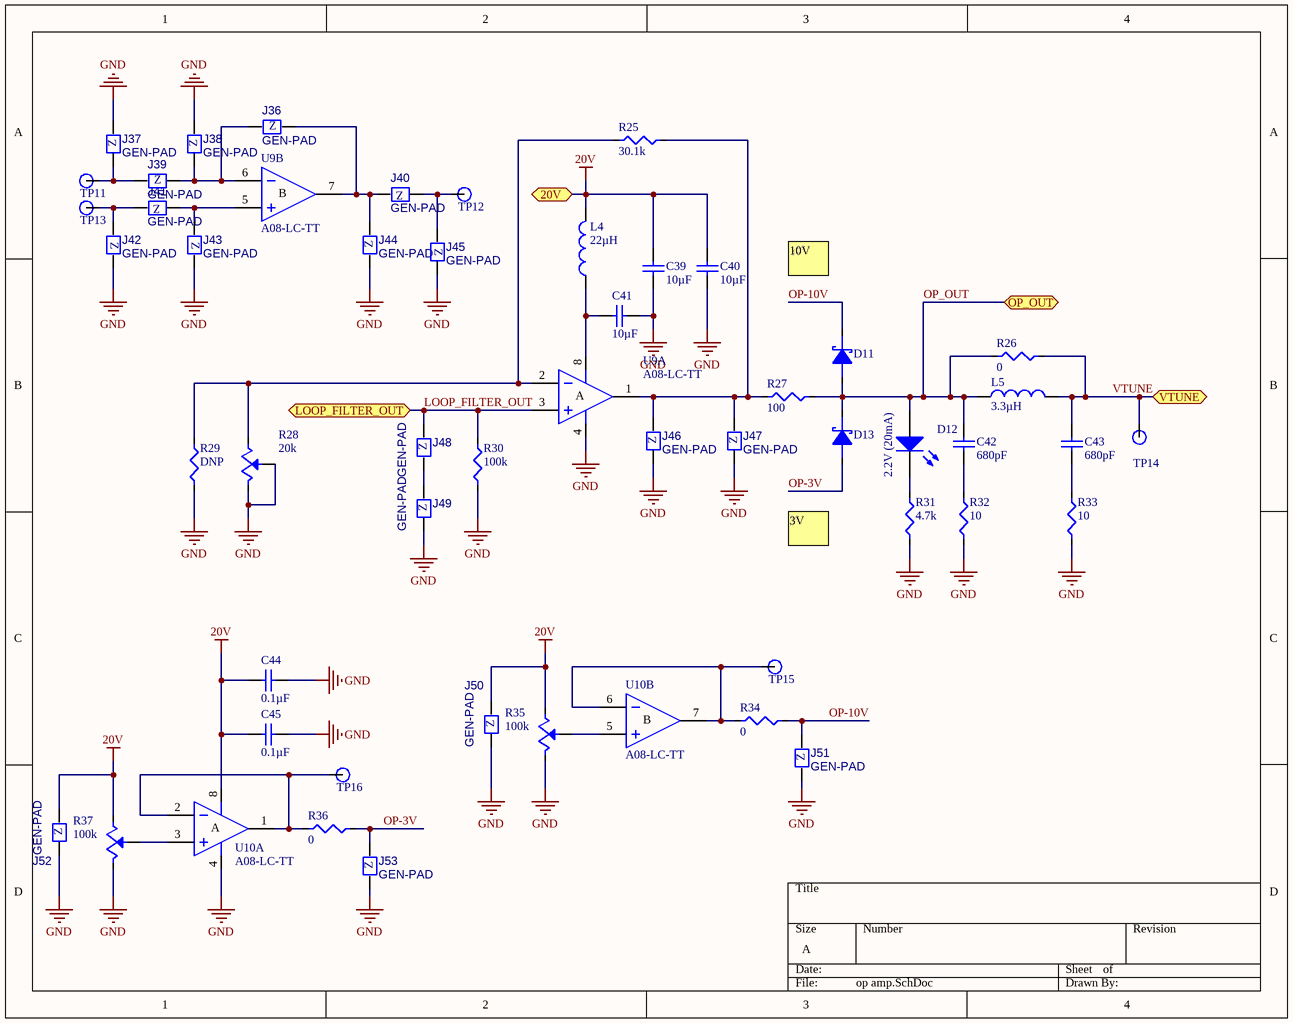
[diagram p3: op amp.SchDoc]

### Parts
C39  10µF  [C1210-2.5mm]
C40  10µF  [C1210-2.5mm]
C41  10µF  [C1210-2.5mm]
C42  680pF  [C0805-1.25MM]
C43  680pF  [C0805-1.25MM]
C44  0.1µF  [C0805-1.25MM]
C45  0.1µF  [C0805-1.25MM]
D11  SCHOTTKY  [SOD-123f]  (value not drawn)
D12  2.2V (20mA)  [0805-LED]
D13  SCHOTTKY  [SOD-123f]  (value not drawn)
J36  GEN-PAD  [0805-DNP]
J37  GEN-PAD  [0805-DNP]
J38  GEN-PAD  [0805-DNP]
J39  GEN-PAD  [0805-DNP]
J40  GEN-PAD  [0805-DNP]
J41  GEN-PAD  [0805-DNP]
J42  GEN-PAD  [0805-DNP]
J43  GEN-PAD  [0805-DNP]
J44  GEN-PAD  [0805-DNP]
J45  GEN-PAD  [0805-DNP]
J46  GEN-PAD  [0805-DNP]
J47  GEN-PAD  [0805-DNP]
J48  GEN-PAD  [0805-DNP]
J49  GEN-PAD  [0805-DNP]
J50  GEN-PAD  [0805-DNP]
J51  GEN-PAD  [0805-DNP]
J52  GEN-PAD  [0805-DNP]
J53  GEN-PAD  [0805-DNP]
L4  value 22µH  [L1210]  (hidden comment: L)
L5  value 3.3µH  [L1210]  (hidden comment: L)
R25  30.1k  [0805-0.45MM]
R26  0  [0805-0.45MM]
R27  100  [0805-0.45MM]
R28  20k  [3310Y]
R29  DNP  [0805-DNP]
R30  100k  [0805-0.45MM]
R31  4.7k  [0805-0.45MM]
R32  10  [0805-0.45MM]
R33  10  [0805-0.45MM]
R34  0  [0805-0.45MM]
R35  100k  [3310Y]
R36  0  [0805-0.45MM]
R37  100k  [3310Y]
TP11  TP-LOOP  [TP-LOOP]  (value not drawn)
TP12  TP-LOOP  [TP-LOOP]  (value not drawn)
TP13  TP-LOOP  [TP-LOOP]  (value not drawn)
TP14  TP-LOOP  [TP-LOOP]  (value not drawn)
TP15  TP-LOOP  [TP-LOOP]  (value not drawn)
TP16  TP-LOOP  [TP-LOOP]  (value not drawn)
U9  A08-LC-TT  [PDIP-8-(7.62mm)-SOCKET]  (parts A,B of 2)
U10  A08-LC-TT  [PDIP-8-(7.62mm)-SOCKET]  (parts A,B of 2)

### Ports
20V, LOOP_FILTER_OUT, OP_OUT, VTUNE

### Nets
20V: C39.2 C40.2 C44.1 C45.1 J50.1 J52.1 L4.2 R35.1 R37.1 U10.8(V+) ; port 20V
GND: C39.1 C40.1 C41.2 C44.2 C45.2 J37.1 J38.1 J42.1 J43.1 J44.2 J45.1 J46.2 J47.2 J49.2 J50.2 J51.2 J52.2 J53.2 R28.2 R28.3 R29.1 R30.1 R31.1 R32.1 R33.1 R35.3 R37.3 U9.4(V-) U10.4(V-)
LOOP_FILTER_OUT: J48.1 R30.2 U9.3(IN+) ; port LOOP_FILTER_OUT
OP-3V: D13.A J53.1 R36.2
OP-10V: D11.C J51.1 R34.2
OP_OUT: C42.2 D11.A D12.A D13.C L5.1 R26.1 R27.2 ; port OP_OUT
VTUNE: C43.2 L5.2 R26.2 TP14.0 ; port VTUNE
NetC41_1: C41.1 L4.1 U9.8(V+)
NetC42_1: C42.1 R32.2
NetC43_1: C43.1 R33.2
NetD12_C: D12.C R31.2
NetJ36_1: J36.1 J40.1 J44.1 U9.7
NetJ36_2: J36.2 J38.2 J39.1 U9.6(IN-)
NetJ37_2: J37.2 J39.2 TP11.0
NetJ40_2: J40.2 J45.2 TP12.0
NetJ41_1: J41.1 J42.2 TP13.0
NetJ41_2: J41.2 J43.2 U9.5(IN+)
NetJ46_1: J46.1 J47.1 R25.2 R27.1 U9.1(OUT)
NetJ48_2: J48.2 J49.1
NetR25_1: R25.1 R28.1 R29.2 U9.2(IN-)
NetR34_1: R34.1 TP15.0 U10.6(IN-) U10.7
NetR35_2: R35.2 U10.5(IN+)
NetR36_1: R36.1 TP16.0 U10.1(OUT) U10.2(IN-)
NetR37_2: R37.2 U10.3(IN+)

### Notes on the sheet
- 10V
- 3V
- (in symbol EE-GEN-00001) Z
- (in symbol EE-OPAMP-00002, part A) A
- (in symbol EE-OPAMP-00002, part B) B
- (in symbol PDIP-8-(7.62mm)-SOCKET, part A) A
- (in symbol PDIP-8-(7.62mm)-SOCKET, part B) B

### Library data of the parts
C39-C41 = EE-CAP-00013: Capacitor; Part Description: CAP CER 10UF 50V 10% X5R 1210; Manufacturer: Taiyo; Manufacturer Part Number: UMK325BJ106KM-T; Record Number: 13; Voltage: 50V; PackageDescription: Chip Capacitor; EE Part Number: EE-CAP-00013; Value: 10µF; Datasheet Link: UMK325BJ106KM-T; Supplier 1: DigiKey; Supplier Part Number 1: 587-2247-1-ND; Supplier Link 1: DigiKey
C42 C43 = EE-CAP-00012: Capacitor; Part Description: CAP CER 680PF 50V 1% NP0 0805; Manufacturer: Kemet; Manufacturer Part Number: C0805C681F5GACTU; Record Number: 12; Voltage: 50V; PackageDescription: Chip Capacitor; EE Part Number: EE-CAP-00012; Value: 680pF; Datasheet Link: C0805C681F5GACTU; Supplier 1: DigiKey; Supplier Part Number 1: 399-8110-1-ND; Supplier Link 1: DigiKey
C44 C45 = EE-CAP-00014: Capacitor; Part Description: CAP CER 0.1UF 50V 10% X7R 0805; Manufacturer: Kemet; Manufacturer Part Number: C0805C104K5RACTU; Record Number: 14; Voltage: 50V; PackageDescription: Chip Capacitor; EE Part Number: EE-CAP-00014; Value: 0.1µF; Datasheet Link: C0805C104K5RACTU; Supplier 1: DigiKey; Supplier Part Number 1: 399-1170-1-ND; Supplier Link 1: DigiKey
D11 D13 = EE-DIODE-00002: Schottky Diode; Part Description: DIODE SCHOTTKY 30V 1A SFLAT; Manufacturer: Toshiba; Manufacturer Part Number: CRS01(TE85L,Q,M); Record Number: 2; Value: 30V (1A); Voltage: 30V; Current: 1A; EE Part Number: EE-DIODE-00002; Datasheet Link: CRS01(TE85L,Q,M); Supplier 1: DigiKey; Supplier Part Number 1: CRS01QCT-ND; Supplier Link 1: DigiKey; Supplier 2: Mouser; Supplier Part Number 2: 757-CRS01(TE85L,Q,M); Supplier Link 2: Mouser
D12 = EE-DIODE-00003: as D5 on sheet supplies; Revision: July-2002: Re-released for DXP Platform.; EE Part Number: EE-DIODE-00003; Value: 2.2V (20mA); Voltage: 2.2V; Current: 20mA; Datasheet Link: LG R971-KN-1; Supplier 1: DigiKey; Supplier Part Number 1: 475-1410-1-ND; Supplier Link 1: DigiKey; Supplier 2: Mouser; Supplier Part Number 2: 720-LGR971-KN-1; Supplier Link 2: Mouser
J36-J53 = EE-GEN-00001: as J1 on sheet supplies; EE Part Number: EE-GEN-00001; Value: GEN-0805; Pins: 2; Manufacturer: N/A; Manufacturer Part Number: N/A; Supplier 1: N/A; Supplier Part Number 1: N/A
L4 = EE-L-00005: Inductor; Part Description: INDUCTOR 22UH 10% 1210 SMD; Manufacturer: Taiyo Yuden; Manufacturer Part Number: CBC3225T220KRV; Record Number: 5; Current: 780mA; Tolerance: ±10%; Resistance: 351 mOhm Max; EE Part Number: EE-L-00005; Datasheet Link: CBC3225T220KRV; Supplier 1: DigiKey; Supplier Part Number 1: 587-3704-1-ND; Supplier Link 1: DigiKey; Supplier 2: Mouser; Supplier Part Number 2: 963-CBC3225T220KRV; Supplier Link 2: Mouser
L5 = EE-L-00006: Inductor; Part Description: INDUCTOR POWER 3.3UH 1210; Manufacturer: TDK; Manufacturer Part Number: NLV32T-3R3J-PF; Record Number: 6; Current: 260mA; Tolerance: ±5%; Resistance: 1.2 Ohm Max; EE Part Number: EE-L-00006; Datasheet Link: NLV32T-3R3J-PF; Supplier 1: DigiKey; Supplier Part Number 1: 445-1520-1-ND; Supplier Link 1: DigiKey
R25 = EM-RES-01089: Part Description: RES 30.1K OHM 1/8W 1% 0805 SMD; Manufacturer: Vishay; Manufacturer Part Number: CRCW080530K1FKEA; Record Number: 1089; Tolerance: 1%; Power: 0.125W; EM Part Number: EM-RES-01089; Value: 30.1k; Supplier 1: Digi-Key; Supplier Part Number 1: 541-30.1KCCT-ND
R26 R34 R36 = EM-RES-01617: as R1 on sheet supplies; EM Part Number: EM-RES-01617; Value: 0; Tolerance: N/A; Datasheet Link: http://www.vishay.com/docs/20043/crcwhpe3.pdf; Supplier 1: Digi-Key; Supplier Part Number 1: 541-0.0TBCT-ND; Supplier Link 1: http://www.Digi-Key.com/product-detail/en/CRCW08050000Z0EAHP/541-0.0TBCT-ND/2222831
R27 = EM-RES-01370: as R2 on sheet supplies; EM Part Number: EM-RES-01370; Value: 100; Supplier 1: Digi-Key; Supplier Part Number 1: 541-100CCT-ND
R28 = EE-POT-00002: POTENTIOMETER; Part Description: POT 20K OHM 9MM SQ PLASTIC; Manufacturer: Bourns; Manufacturer Part Number: 3310Y-001-203L; Record Number: 2; Tolerance: ±20%; Power: 0.25W, 1/4W; EE Part Number: EE-POT-00002; Value: 20k; Datasheet Link: 3310Y-001-203L; Supplier 1: DigiKey; Supplier Part Number 1: 3310Y-001-203L-ND; Supplier Link 1: DigiKey; Supplier 2: Mouser; Supplier Part Number 2: 652-3310Y-001-203L; Supplier Link 2: Mouser
R29 = EM-RES-01607: Part Description: DNP 0805 JUMPER; Record Number: 1607; EM Part Number: EM-RES-01607; Value: DNP; Tolerance: N/A; Power: N/A; Manufacturer: N/A; Manufacturer Part Number: N/A; Datasheet Link: N/A; Supplier 1: N/A; Supplier Part Number 1: N/A; Supplier Link 1: N/A
R30 = EM-RES-01028: Part Description: RES 100K OHM 1/8W 1% 0805 SMD; Manufacturer: Vishay; Manufacturer Part Number: CRCW0805100KFKEA; Record Number: 1028; Tolerance: 1%; Power: 0.125W; EM Part Number: EM-RES-01028; Value: 100k; Supplier 1: Digi-Key; Supplier Part Number 1: 541-100KCCT-ND
R31 = EM-RES-01180: Part Description: RES 4.70K OHM 1/8W 1% 0805 SMD; Manufacturer: Vishay; Manufacturer Part Number: CRCW08054K70FKEA; Record Number: 1180; Tolerance: 1%; Power: 0.125W; EM Part Number: EM-RES-01180; Value: 4.7k; Supplier 1: Digi-Key; Supplier Part Number 1: 541-4.70KCCT-ND
R32 R33 = EM-RES-01484: Part Description: RES 10.0 OHM 1/8W 1% 0805 SMD; Manufacturer: Vishay; Manufacturer Part Number: CRCW080510R0FKEA; Record Number: 1484; Tolerance: 1%; Power: 0.125W; EM Part Number: EM-RES-01484; Value: 10; Supplier 1: Digi-Key; Supplier Part Number 1: 541-10.0CCT-ND
R35 R37 = EE-POT-00003: POTENTIOMETER; Part Description: POT 100K OHM 9MM SQ PLASTIC; Manufacturer: Bourns; Manufacturer Part Number: 3310Y-001-104L; Record Number: 3; Tolerance: ±20%; Power: 0.25W, 1/4W; EE Part Number: EE-POT-00003; Value: 100k; Datasheet Link: 3310Y-001-104L; Supplier 1: DigiKey; Supplier Part Number 1: 3310Y-001-104L-ND; Supplier Link 1: DigiKey; Supplier 2: Mouser; Supplier Part Number 2: 652-3310Y-001-104L; Supplier Link 2: Mouser
TP11-TP16 = EM-TP-00006: as TP1 on sheet supplies; EM Part Number: EM-TP-00006; Value: TP-LOOP; Pins: 1; Manufacturer: N/A; Manufacturer Part Number: N/A; Supplier 1: N/A; Supplier Part Number 1: N/A
U9 = EE-OPAMP-00002: OP284; Part Description: DNP-Socket; Manufacturer: Assmann; Record Number: 2; EE Part Number: EE-OPAMP-00002; Value: A08-LC-TT; Voltage: N/A; Drive Current: N/A; Channels: 2; Package: PDIP-8; Manufacturer Part Number: A08-LC-TT; Datasheet Link: A08-LC-TT; Supplier 1: DigiKey; Supplier Part Number 1: AE9986-ND; Supplier Link 1: DigiKey
U10 = PDIP-8-(7.62mm)-SOCKET: OP284; EE Part Number: EE-OPAMP-00002; Part Description: DNP-Socket; Manufacturer: Assmann; Record Number: 2; Value: A08-LC-TT; Voltage: N/A; Drive Current: N/A; Channels: 2; Package: PDIP-8; Manufacturer Part Number: A08-LC-TT; Datasheet Link: A08-LC-TT; Supplier 1: DigiKey; Supplier Part Number 1: AE9986-ND; Supplier Link 1: DigiKey

## Sheet pll-filters.SchDoc
size A
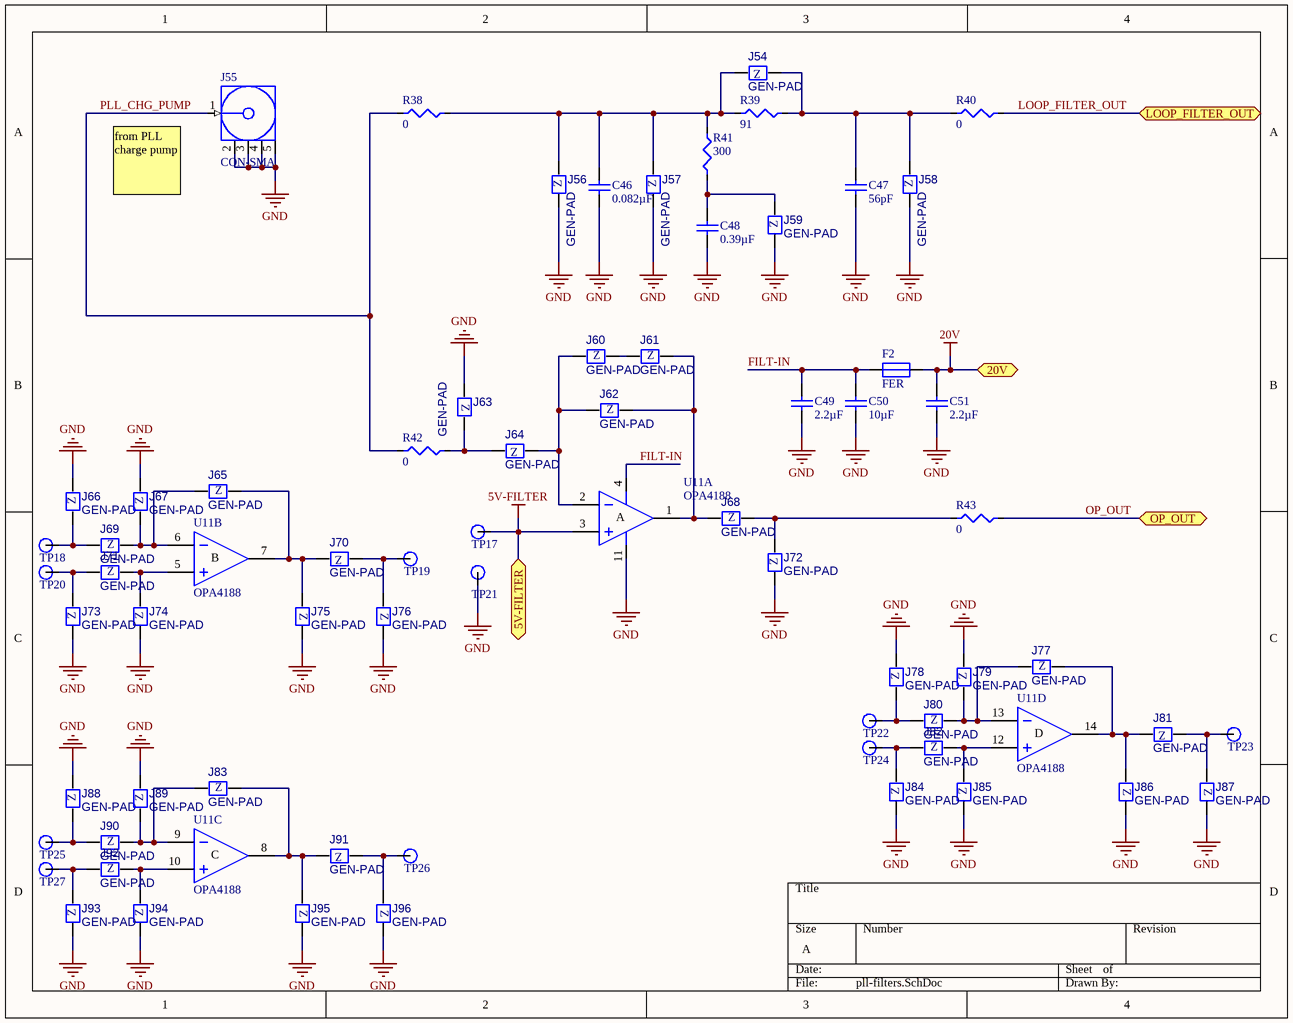
[diagram p4: pll-filters.SchDoc]

### Parts
C46  0.082µF  [C0603-0.8MM]
C47  56pF  [0402-0.55mm]
C48  0.39µF  [0805-1.35MM]
C49  2.2µF  [0402-0.55mm]
C50  10µF  [C0805-1.25MM]
C51  2.2µF  [0402-0.55mm]
F2  FER  [0603-0.8mm]
J54  GEN-PAD  [0402-DNP]
J55  CON-SMA  [CON-COAX]
J56  GEN-PAD  [0805-DNP]
J57  GEN-PAD  [0402-DNP]
J58  GEN-PAD  [0805-DNP]
J59  GEN-PAD  [0402-DNP]
J60  GEN-PAD  [0805-DNP]
J61  GEN-PAD  [0805-DNP]
J62  GEN-PAD  [0805-DNP]
J63  GEN-PAD  [0805-DNP]
J64  GEN-PAD  [0805-DNP]
J65  GEN-PAD  [0805-DNP]
J66  GEN-PAD  [0805-DNP]
J67  GEN-PAD  [0805-DNP]
J68  GEN-PAD  [0805-DNP]
J69  GEN-PAD  [0805-DNP]
J70  GEN-PAD  [0805-DNP]
J71  GEN-PAD  [0805-DNP]
J72  GEN-PAD  [0805-DNP]
J73  GEN-PAD  [0805-DNP]
J74  GEN-PAD  [0805-DNP]
J75  GEN-PAD  [0805-DNP]
J76  GEN-PAD  [0805-DNP]
J77  GEN-PAD  [0805-DNP]
J78  GEN-PAD  [0805-DNP]
J79  GEN-PAD  [0805-DNP]
J80  GEN-PAD  [0805-DNP]
J81  GEN-PAD  [0805-DNP]
J82  GEN-PAD  [0805-DNP]
J83  GEN-PAD  [0805-DNP]
J84  GEN-PAD  [0805-DNP]
J85  GEN-PAD  [0805-DNP]
J86  GEN-PAD  [0805-DNP]
J87  GEN-PAD  [0805-DNP]
J88  GEN-PAD  [0805-DNP]
J89  GEN-PAD  [0805-DNP]
J90  GEN-PAD  [0805-DNP]
J91  GEN-PAD  [0805-DNP]
J92  GEN-PAD  [0805-DNP]
J93  GEN-PAD  [0805-DNP]
J94  GEN-PAD  [0805-DNP]
J95  GEN-PAD  [0805-DNP]
J96  GEN-PAD  [0805-DNP]
R38  0  [0805-0.45MM]
R39  91  [0805-0.45MM]
R40  0  [0805-0.45MM]
R41  300  [0805-0.45MM]
R42  0  [0805-0.45MM]
R43  0  [0805-0.45MM]
TP17  TP-LOOP  [TP-LOOP]  (value not drawn)
TP18  TP-LOOP  [TP-LOOP]  (value not drawn)
TP19  TP-LOOP  [TP-LOOP]  (value not drawn)
TP20  TP-LOOP  [TP-LOOP]  (value not drawn)
TP21  TP-LOOP  [TP-LOOP]  (value not drawn)
TP22  TP-LOOP  [TP-LOOP]  (value not drawn)
TP23  TP-LOOP  [TP-LOOP]  (value not drawn)
TP24  TP-LOOP  [TP-LOOP]  (value not drawn)
TP25  TP-LOOP  [TP-LOOP]  (value not drawn)
TP26  TP-LOOP  [TP-LOOP]  (value not drawn)
TP27  TP-LOOP  [TP-LOOP]  (value not drawn)
U11  OPA4188  [TSSOP14]  (parts A,B,C,D of 4)

### Ports
5V-FILTER, 20V, LOOP_FILTER_OUT, OP_OUT

### Nets
5V-FILTER: TP17.0 U11.3(IN+) ; port 5V-FILTER
20V: C51.2 F2.1 ; port 20V
GND: C46.1 C47.1 C48.1 C49.1 C50.1 C51.1 J55.2(GND) J55.3(GND) J55.4(GND) J55.5(GND) J56.2 J57.2 J58.2 J59.2 J63.2 J66.1 J67.1 J72.2 J73.2 J74.2 J75.1 J76.1 J78.1 J79.1 J84.2 J85.2 J86.1 J87.1 J88.1 J89.1 J93.2 J94.2 J95.1 J96.1 TP21.0 U11.11(V-)
FILT-IN: C49.2 C50.2 F2.2 U11.4(V+)
LOOP_FILTER_OUT: R40.2 ; port LOOP_FILTER_OUT
OP_OUT: R43.2 ; port OP_OUT
PLL_CHG_PUMP: J55.1(Signal) R38.1 R42.1
NetC46_2: C46.2 J54.1 J56.1 J57.1 R38.2 R39.1 R41.2
NetC47_2: C47.2 J54.2 J58.1 R39.2 R40.1
NetC48_2: C48.2 J59.1 R41.1
NetJ60_1: J60.1 J61.2
NetJ60_2: J60.2 J62.2 J64.2 U11.2(IN-)
NetJ61_1: J61.1 J62.1 J68.2 U11.1(OUT)
NetJ63_1: J63.1 J64.1 R42.2
NetJ65_1: J65.1 J70.1 J75.2 U11.7(OUT)
NetJ65_2: J65.2 J67.2 J69.1 U11.6(IN-)
NetJ66_2: J66.2 J69.2 TP18.0
NetJ68_1: J68.1 J72.1 R43.1
NetJ70_2: J70.2 J76.2 TP19.0
NetJ71_1: J71.1 J74.1 U11.5(IN+)
NetJ71_2: J71.2 J73.1 TP20.0
NetJ77_1: J77.1 J81.1 J86.2 U11.14(OUT)
NetJ77_2: J77.2 J79.2 J80.1 U11.13(IN-)
NetJ78_2: J78.2 J80.2 TP22.0
NetJ81_2: J81.2 J87.2 TP23.0
NetJ82_1: J82.1 J85.1 U11.12(IN+)
NetJ82_2: J82.2 J84.1 TP24.0
NetJ83_1: J83.1 J91.1 J95.2 U11.8(OUT)
NetJ83_2: J83.2 J89.2 J90.1 U11.9(IN-)
NetJ88_2: J88.2 J90.2 TP25.0
NetJ91_2: J91.2 J96.2 TP26.0
NetJ92_1: J92.1 J94.1 U11.10(IN+)
NetJ92_2: J92.2 J93.1 TP27.0

### Notes on the sheet
- (near J55) from PLL charge pump
- (in symbol EE-GEN-00001) Z
- (in symbol EE-GEN-00002) Z
- (in symbol TSSOP14, part A) A
- (in symbol TSSOP14, part B) B
- (in symbol TSSOP14, part C) C
- (in symbol TSSOP14, part D) D

### Library data of the parts
C46 = EE-CAP-00005: Capacitor; Part Description: CAP CER 0.082UF 25V 10% X7R 0603; Manufacturer: Kemet; Manufacturer Part Number: C0603C823K3RACTU; Record Number: 5; Voltage: 25V; PackageDescription: Chip Capacitor; EE Part Number: EE-CAP-00005; Value: 0.082µF; Datasheet Link: C0603C823K3RACTU; Supplier 1: DigiKey; Supplier Part Number 1: 399-9128-1-ND; Supplier Link 1: DigiKey; Supplier 2: Mouser; Supplier Part Number 2: C0603C823K3RACTU; Supplier Link 2: Mouser
C47 = EE-CAP-00007: Capacitor; Part Description: CAP CER 56PF 50V 1% NP0 0402; Manufacturer: Murata; Manufacturer Part Number: GRM1555C1H560FA01D; Record Number: 7; Voltage: 50V; PackageDescription: Chip Capacitor; EE Part Number: EE-CAP-00007; Value: 56pF; Datasheet Link: GRM1555C1H560FA01D; Supplier 1: DigiKey; Supplier Part Number 1: 490-8211-1-ND; Supplier Link 1: DigiKey; Supplier 2: Mouser; Supplier Part Number 2: 81-GRM1555C1H560FA1D; Supplier Link 2: Mouser
C48 = EE-CAP-00006: Capacitor; Part Description: CAP CER 0.39UF 25V 10% X7R 0805; Manufacturer: Kemet; Manufacturer Part Number: C0805C394K3RACTU; Record Number: 6; Voltage: 25V; PackageDescription: Chip Capacitor; EE Part Number: EE-CAP-00006; Value: 0.39µF; Datasheet Link: C0805C394K3RACTU; Supplier 1: DigiKey; Supplier Part Number 1: 399-9238-1-ND; Supplier Link 1: DigiKey; Supplier 2: Mouser; Supplier Part Number 2: 80-C0805C394K3R; Supplier Link 2: Mouser
C49 C51 = EE-CAP-00003: as C10 on sheet supplies; PackageDescription: Chip Capacitor; EE Part Number: EE-CAP-00003; Value: 2.2µF; Datasheet Link: C1005X5R1V225K050BC; Supplier 1: DigiKey; Supplier Part Number 1: 445-9028-1-ND; Supplier Link 1: DigiKey; Supplier 2: Mouser; Supplier Part Number 2: 810-C1005X5R1V225K; Supplier Link 2: Mouser
C50 = EE-CAP-00002: as C11 on sheet supplies; PackageDescription: Chip Capacitor; EE Part Number: EE-CAP-00002; Value: 10µF; Datasheet Link: C2012JB1V106K085AC; Supplier 1: DigiKey; Supplier Part Number 1: 445-11516-1-ND; Supplier Link 1: DigiKey
F2 = EE-FER-00001: as F1 on sheet vco; EE Part Number: EE-FER-00001; Datasheet Link: HZ0603A222R-10; Supplier 1: DigiKey; Supplier Part Number 1: 240-2377-1-ND; Supplier Link 1: DigiKey; Supplier 2: Mouser; Supplier Part Number 2: 875-HZ0603A222R-10; Supplier Link 2: Mouser
J54 J57 J59 = EE-GEN-00002: as J16 on sheet vco; EE Part Number: EE-GEN-00002; Value: GEN-0402; Pins: 2; Manufacturer: N/A; Manufacturer Part Number: N/A; Supplier 1: N/A; Supplier Part Number 1: N/A
J55 = EE-CON-00001: as J26 on sheet vco; EE Part Number: EE-CON-00001; Pins: 5; Datasheet Link: PSF-S01-008; Supplier 1: ECM; Supplier Part Number 1: PSF-S01-008; Supplier Link 1: ECM
J56 J58 J60-J96 = EE-GEN-00001: as J1 on sheet supplies; EE Part Number: EE-GEN-00001; Value: GEN-0805; Pins: 2; Manufacturer: N/A; Manufacturer Part Number: N/A; Supplier 1: N/A; Supplier Part Number 1: N/A
R38 R40 R42 R43 = EM-RES-01617: as R1 on sheet supplies; EM Part Number: EM-RES-01617; Value: 0; Tolerance: N/A; Datasheet Link: http://www.vishay.com/docs/20043/crcwhpe3.pdf; Supplier 1: Digi-Key; Supplier Part Number 1: 541-0.0TBCT-ND; Supplier Link 1: http://www.Digi-Key.com/product-detail/en/CRCW08050000Z0EAHP/541-0.0TBCT-ND/2222831
R39 = EM-RES-01374: Part Description: RES 91.0 OHM 1/8W 1% 0805 SMD; Manufacturer: Vishay; Manufacturer Part Number: CRCW080591R0FKEA; Record Number: 1374; Tolerance: 1%; Power: 0.125W; EM Part Number: EM-RES-01374; Value: 91; Supplier 1: Digi-Key; Supplier Part Number 1: 541-91.0CCT-ND
R41 = EM-RES-01318: Part Description: RES 300 OHM 1/8W 1% 0805 SMD; Manufacturer: Vishay; Manufacturer Part Number: CRCW0805300RFKEA; Record Number: 1318; Tolerance: 1%; Power: 0.125W; EM Part Number: EM-RES-01318; Value: 300; Supplier 1: Digi-Key; Supplier Part Number 1: 541-300CCT-ND
TP17-TP27 = EM-TP-00006: as TP1 on sheet supplies; EM Part Number: EM-TP-00006; Value: TP-LOOP; Pins: 1; Manufacturer: N/A; Manufacturer Part Number: N/A; Supplier 1: N/A; Supplier Part Number 1: N/A
U11 = TSSOP14: Quad Op-Aamp; EE Part Number: EE-OPAMP-00004; Part Description: IC OPAMP ZERO-DRIFT 2MHZ 14TSSOP; Manufacturer: TI; Record Number: 4; Frequency Range: 2MHz; Value: OPA4188AIPW; Voltage: 4 V ~ 36 V, ±2 V ~ 18 V; Drive Current: 415µA; Channels: 4; Package: 14-TSSOP; Manufacturer Part Number: OPA4188AIPW; Datasheet Link: OPA4188AIPW; Supplier 1: DigiKey; Supplier Part Number 1: 296-36432-5-ND; Supplier Link 1: DigiKey; Supplier 2: Mouser; Supplier Part Number 2: 595-OPA4188AIPW; Supplier Link 2: Mouser

## Nets that join several sheets
5V-FILTER: supplies (R15.2 TP10.0), pll-filters (TP17.0 U11.3)
5V-VCO: supplies (6 pins), vco (F1.2)
8V: supplies (8 pins), vco (6 pins)
20V: supplies (10 pins), op amp (10 pins), pll-filters (C51.2 F2.1)
GND: supplies (59 pins), vco (54 pins), op amp (29 pins), pll-filters (36 pins)
LOOP_FILTER_OUT: op amp (J48.1 R30.2 U9.3), pll-filters (R40.2)
OP_OUT: op amp (7 pins), pll-filters (R43.2)
VTUNE: vco (U6.4), op amp (C43.2 L5.2 R26.2 TP14.0)